# Altium schematic sheet Supplies_LDOs.SchDoc
size 406 x 406 mm
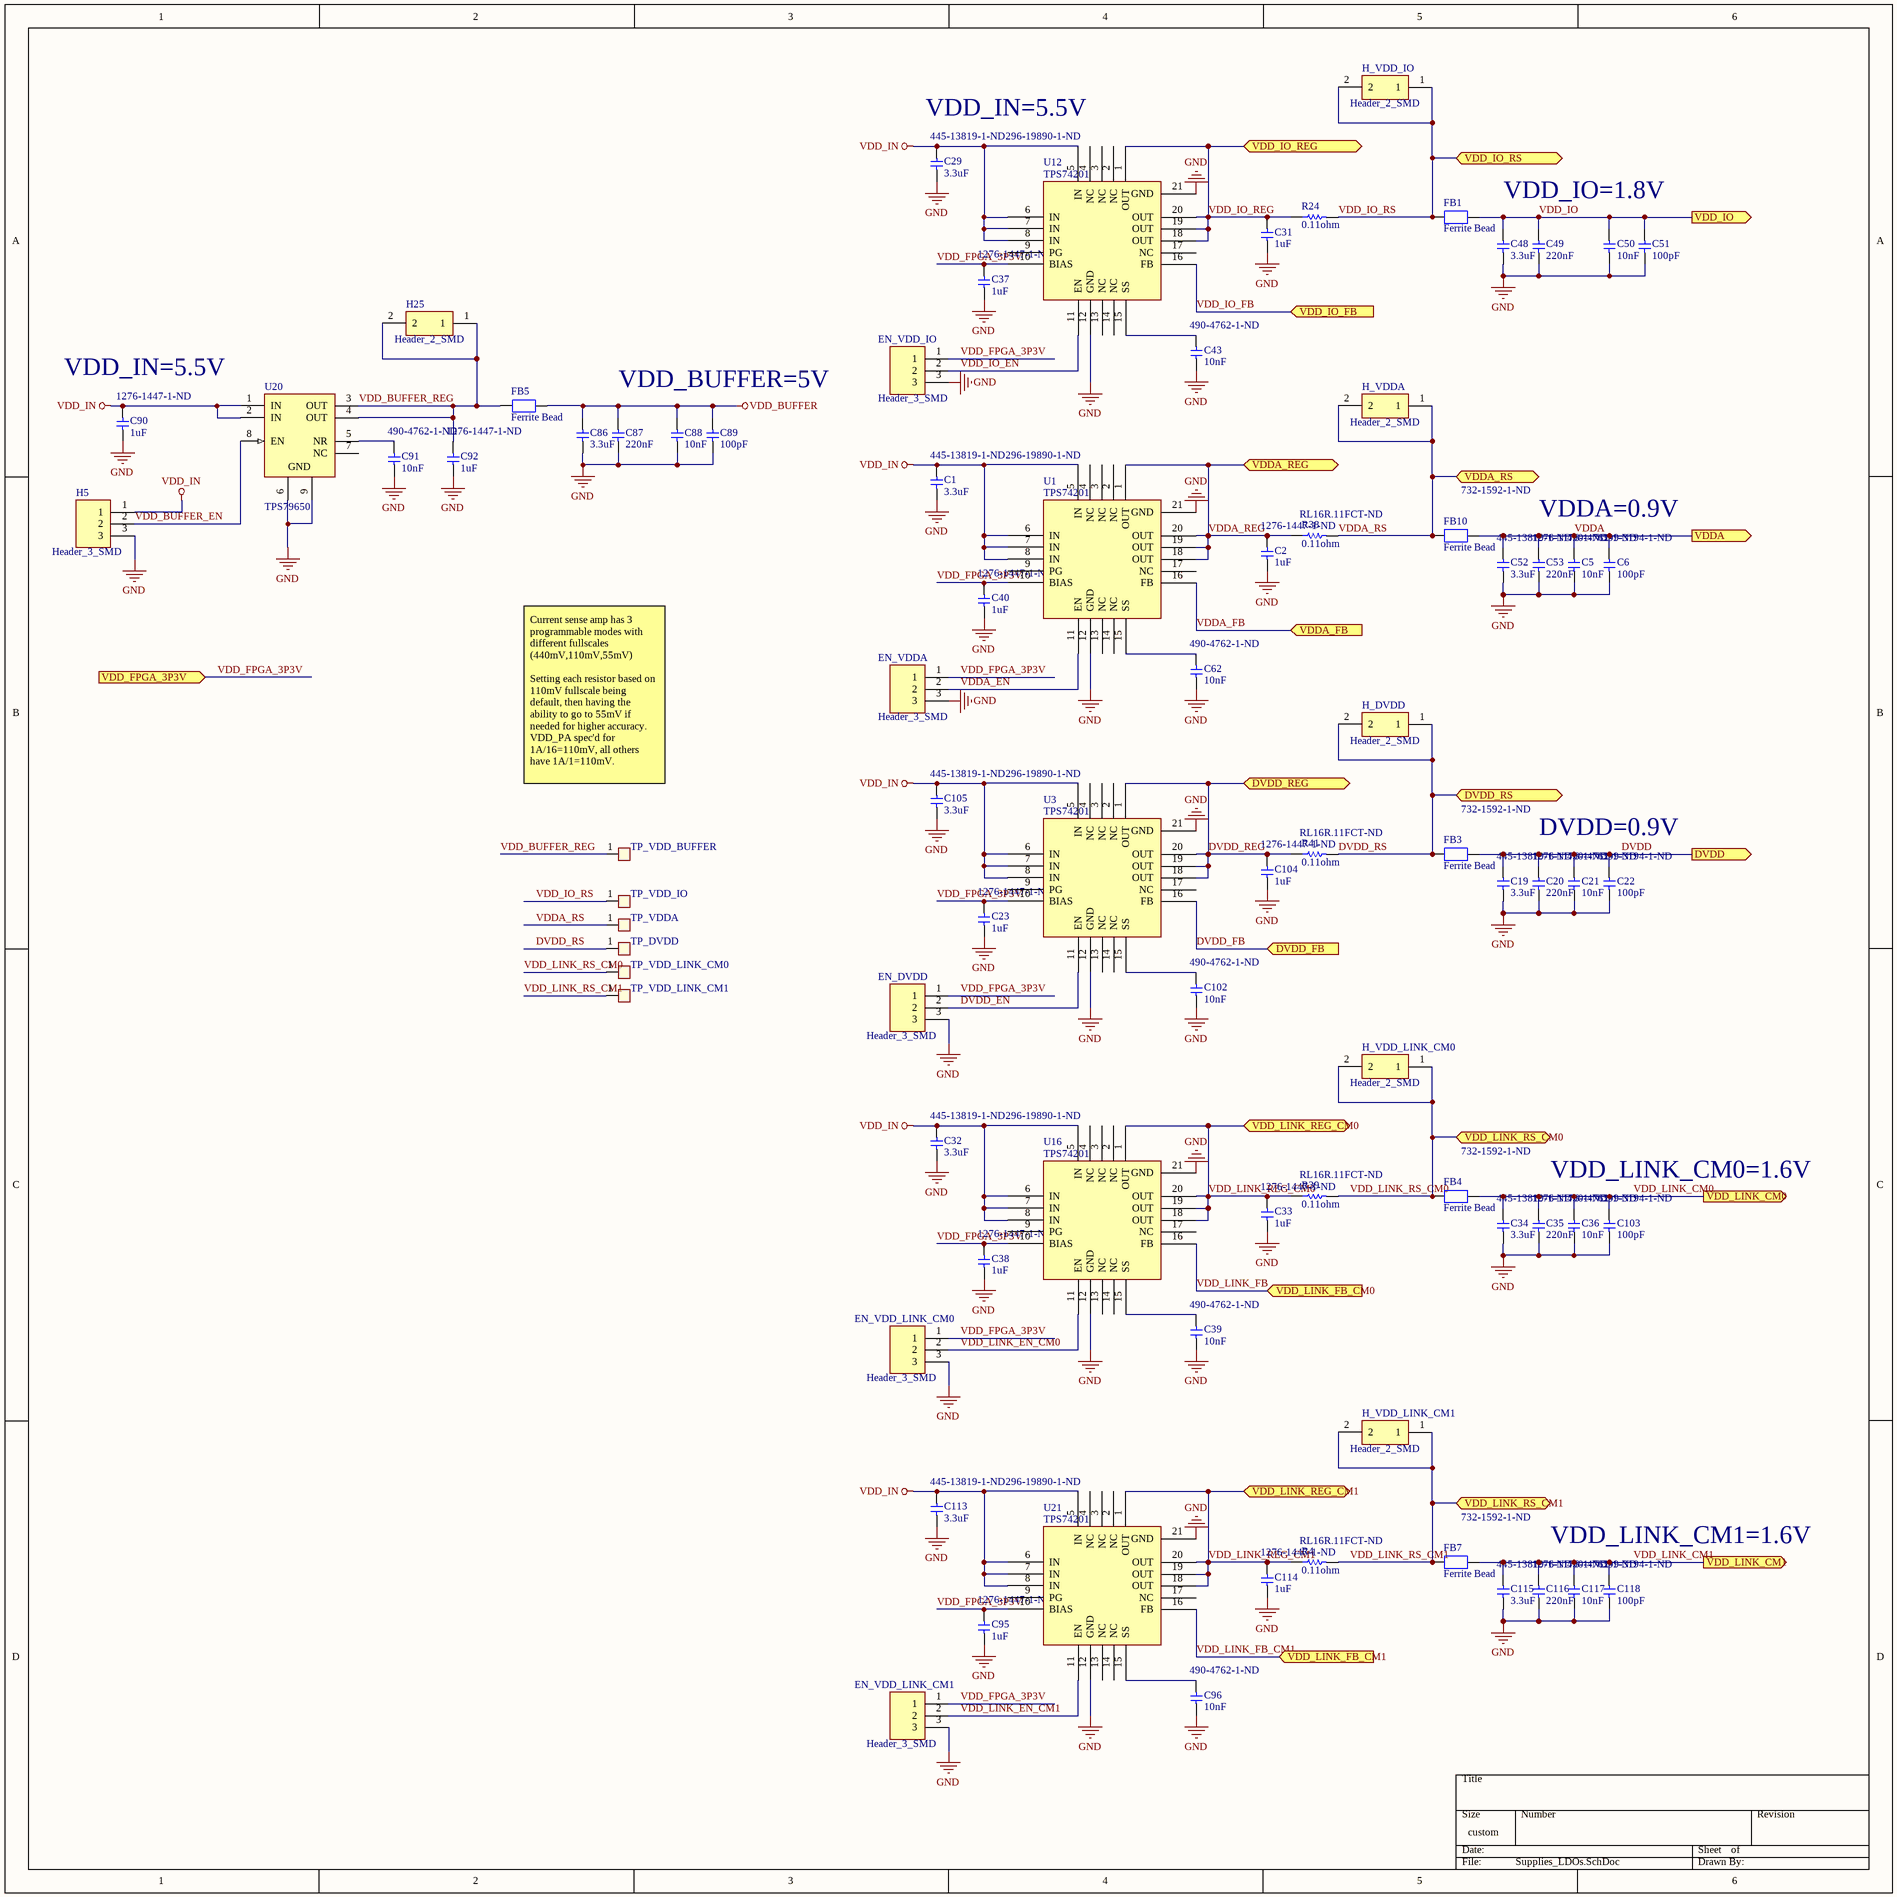
[diagram p0: Supplies_LDOs.SchDoc]

## Parts
C1  3.3uF  Supplier Part Number 1: 445-13819-1-ND  [CAP_0402]
C2  1uF  Supplier Part Number 1: 1276-1447-1-ND  [CAP_0402]
C5  10nF  Supplier Part Number 1: 490-4762-1-ND  [CAPC1005X06L_HD]
C6  100pF  Supplier Part Number 1: 399-3194-1-ND  [CAPC1005X06L_HD]
C19  3.3uF  Supplier Part Number 1: 445-13819-1-ND  [CAP_0402]
C20  220nF  Supplier Part Number 1: 1276-1176-1-ND  [CAP_0402]
C21  10nF  Supplier Part Number 1: 490-4762-1-ND  [CAPC1005X06L_HD]
C22  100pF  Supplier Part Number 1: 399-3194-1-ND  [CAPC1005X06L_HD]
C23  1uF  Supplier Part Number 1: 1276-1447-1-ND  [CAP_0402]
C29  3.3uF  Supplier Part Number 1: 445-13819-1-ND  [CAP_0402]
C31  1uF  [CAP_0402]
C32  3.3uF  Supplier Part Number 1: 445-13819-1-ND  [CAP_0402]
C33  1uF  Supplier Part Number 1: 1276-1447-1-ND  [CAP_0402]
C34  3.3uF  Supplier Part Number 1: 445-13819-1-ND  [CAP_0402]
C35  220nF  Supplier Part Number 1: 1276-1176-1-ND  [CAP_0402]
C36  10nF  Supplier Part Number 1: 490-4762-1-ND  [CAPC1005X06L_HD]
C37  1uF  Supplier Part Number 1: 1276-1447-1-ND  [CAP_0402]
C38  1uF  Supplier Part Number 1: 1276-1447-1-ND  [CAP_0402]
C39  10nF  Supplier Part Number 1: 490-4762-1-ND  [CAPC1005X06L_HD]
C40  1uF  Supplier Part Number 1: 1276-1447-1-ND  [CAP_0402]
C43  10nF  Supplier Part Number 1: 490-4762-1-ND  [CAPC1005X06L_HD]
C48  3.3uF  [CAP_0402]
C49  220nF  [CAP_0402]
C50  10nF  [CAPC1005X06L_HD]
C51  100pF  [CAPC1005X06L_HD]
C52  3.3uF  Supplier Part Number 1: 445-13819-1-ND  [CAP_0402]
C53  220nF  Supplier Part Number 1: 1276-1176-1-ND  [CAP_0402]
C62  10nF  Supplier Part Number 1: 490-4762-1-ND  [CAPC1005X06L_HD]
C86  3.3uF  [CAP_0402]
C87  220nF  [CAP_0402]
C88  10nF  [CAPC1005X06L_HD]
C89  100pF  [CAPC1005X06L_HD]
C90  1uF  Supplier Part Number 1: 1276-1447-1-ND  [CAP_0402]
C91  10nF  Supplier Part Number 1: 490-4762-1-ND  [CAPC1005X06L_HD]
C92  1uF  Supplier Part Number 1: 1276-1447-1-ND  [CAP_0402]
C95  1uF  Supplier Part Number 1: 1276-1447-1-ND  [CAP_0402]
C96  10nF  Supplier Part Number 1: 490-4762-1-ND  [CAPC1005X06L_HD]
C102  10nF  Supplier Part Number 1: 490-4762-1-ND  [CAPC1005X06L_HD]
C103  100pF  Supplier Part Number 1: 399-3194-1-ND  [CAPC1005X06L_HD]
C104  1uF  Supplier Part Number 1: 1276-1447-1-ND  [CAP_0402]
C105  3.3uF  Supplier Part Number 1: 445-13819-1-ND  [CAP_0402]
C113  3.3uF  Supplier Part Number 1: 445-13819-1-ND  [CAP_0402]
C114  1uF  Supplier Part Number 1: 1276-1447-1-ND  [CAP_0402]
C115  3.3uF  Supplier Part Number 1: 445-13819-1-ND  [CAP_0402]
C116  220nF  Supplier Part Number 1: 1276-1176-1-ND  [CAP_0402]
C117  10nF  Supplier Part Number 1: 490-4762-1-ND  [CAPC1005X06L_HD]
C118  100pF  Supplier Part Number 1: 399-3194-1-ND  [CAPC1005X06L_HD]
EN_DVDD  Header_3_SMD  [HDR1X3_SMD]
EN_VDD_IO  Header_3_SMD  [HDR1X3_SMD]
EN_VDD_LINK_CM0  Header_3_SMD  [HDR1X3_SMD]
EN_VDD_LINK_CM1  Header_3_SMD  [HDR1X3_SMD]
EN_VDDA  Header_3_SMD  [HDR1X3_SMD]
FB1  Ferrite Bead  [FER_SMD-0603]
FB3  Ferrite Bead  Supplier Part Number 1: 732-1592-1-ND  [FER_SMD-0603]
FB4  Ferrite Bead  Supplier Part Number 1: 732-1592-1-ND  [FER_SMD-0603]
FB5  Ferrite Bead  [FER_SMD-0603]
FB7  Ferrite Bead  Supplier Part Number 1: 732-1592-1-ND  [FER_SMD-0603]
FB10  Ferrite Bead  Supplier Part Number 1: 732-1592-1-ND  [FER_SMD-0603]
H5  Header_3_SMD  [HDR1X3_SMD]
H25  Header_2_SMD  [HDR1X2_SMD_S]
H_DVDD  Header_2_SMD  [HDR1X2_SMD_S]
H_VDD_IO  Header_2_SMD  [HDR1X2_SMD_S]
H_VDD_LINK_CM0  Header_2_SMD  [HDR1X2_SMD_S]
H_VDD_LINK_CM1  Header_2_SMD  [HDR1X2_SMD_S]
H_VDDA  Header_2_SMD  [HDR1X2_SMD_S]
R4  0.11ohm  Supplier Part Number 1: RL16R.11FCT-ND  [RES_1206]
R24  0.11ohm  [RES_1206]
R38  0.11ohm  Supplier Part Number 1: RL16R.11FCT-ND  [RES_1206]
R39  0.11ohm  Supplier Part Number 1: RL16R.11FCT-ND  [RES_1206]
R41  0.11ohm  Supplier Part Number 1: RL16R.11FCT-ND  [RES_1206]
TP_DVDD  TestPoint_SMD  [TestPoint_SMD]  (value not drawn)
TP_VDD_BUFFER  TestPoint_SMD  [TestPoint_SMD]  (value not drawn)
TP_VDD_IO  TestPoint_SMD  [TestPoint_SMD]  (value not drawn)
TP_VDD_LINK_CM0  TestPoint_SMD  [TestPoint_SMD]  (value not drawn)
TP_VDD_LINK_CM1  TestPoint_SMD  [TestPoint_SMD]  (value not drawn)
TP_VDDA  TestPoint_SMD  [TestPoint_SMD]  (value not drawn)
U1  TPS74201  Supplier Part Number 1: 296-19890-1-ND  [TPS74201_NPV]
U3  TPS74201  Supplier Part Number 1: 296-19890-1-ND  [TPS74201_NPV]
U12  TPS74201  Supplier Part Number 1: 296-19890-1-ND  [TPS74201_NPV]
U16  TPS74201  Supplier Part Number 1: 296-19890-1-ND  [TPS74201_NPV]
U20  TPS79650  [TI-DRB8-2400X1650TP_V]
U21  TPS74201  Supplier Part Number 1: 296-19890-1-ND  [TPS74201_NPV]

## Ports
DVDD (out), DVDD_FB (in), DVDD_REG (bidir), DVDD_RS (bidir), VDD_FPGA_3P3V (in), VDD_IO (out), VDD_IO_FB (in), VDD_IO_REG (bidir), VDD_IO_RS (bidir), VDD_LINK_CM0 (out), VDD_LINK_CM1 (out), VDD_LINK_FB_CM0 (in), VDD_LINK_FB_CM1 (in), VDD_LINK_REG_CM0 (bidir), VDD_LINK_REG_CM1 (bidir), VDD_LINK_RS_CM0 (bidir), VDD_LINK_RS_CM1 (bidir), VDDA (out), VDDA_FB (in), VDDA_REG (bidir), VDDA_RS (bidir)

## Nets
GND: C1.2 C2.2 C5.2 C6.2 C19.2 C20.2 C21.2 C22.2 C23.2 C29.2 C31.2 C32.2 C33.2 C34.2 C35.2 C36.2 C37.2 C38.2 C39.2 C40.2 C43.2 C48.2 C49.2 C50.2 C51.2 C52.2 C53.2 C62.2 C86.2 C87.2 C88.2 C89.2 C90.2 C91.2 C92.2 C95.2 C96.2 C102.2 C103.2 C104.2 C105.2 C113.2 C114.2 C115.2 C116.2 C117.2 C118.2 EN_DVDD.3 EN_VDD_IO.3 EN_VDD_LINK_CM0.3 EN_VDD_LINK_CM1.3 EN_VDDA.3 H5.3 U1.12(GND) U1.21(GND) U3.12(GND) U3.21(GND) U12.12(GND) U12.21(GND) U16.12(GND) U16.21(GND) U20.6(GND) U20.9(GND) U21.12(GND) U21.21(GND)
VDD_BUFFER: C86.1 C87.1 C88.1 C89.1 FB5.2
VDD_IN: C1.1 C29.1 C32.1 C90.1 C105.1 C113.1 H5.1 U1.5(IN) U1.6(IN) U1.7(IN) U1.8(IN) U3.5(IN) U3.6(IN) U3.7(IN) U3.8(IN) U12.5(IN) U12.6(IN) U12.7(IN) U12.8(IN) U16.5(IN) U16.6(IN) U16.7(IN) U16.8(IN) U20.1(IN) U20.2(IN) U21.5(IN) U21.6(IN) U21.7(IN) U21.8(IN)
DVDD: C19.1 C20.1 C21.1 C22.1 FB3.2 ; port DVDD
DVDD_EN: EN_DVDD.2 U3.11(EN)
DVDD_FB: U3.16(FB) ; port DVDD_FB
DVDD_REG: C104.1 R41.1(TOP) U3.1(OUT) U3.18(OUT) U3.19(OUT) U3.20(OUT) ; port DVDD_REG
DVDD_RS: FB3.1 H_DVDD.1 H_DVDD.2 R41.2(BOT) TP_DVDD.1(TP) ; port DVDD_RS
VDD_BUFFER_EN: H5.2 U20.8(EN)
VDD_BUFFER_REG: C92.1 FB5.1 H25.1 H25.2 TP_VDD_BUFFER.1(TP) U20.3(OUT) U20.4(OUT)
VDD_FPGA_3P3V: C23.1 C37.1 C38.1 C40.1 C95.1 EN_DVDD.1 EN_VDD_IO.1 EN_VDD_LINK_CM0.1 EN_VDD_LINK_CM1.1 EN_VDDA.1 U1.10(BIAS) U3.10(BIAS) U12.10(BIAS) U16.10(BIAS) U21.10(BIAS) ; port VDD_FPGA_3P3V
VDD_IO: C48.1 C49.1 C50.1 C51.1 FB1.2 ; port VDD_IO
VDD_IO_EN: EN_VDD_IO.2 U12.11(EN)
VDD_IO_FB: U12.16(FB) ; port VDD_IO_FB
VDD_IO_REG: C31.1 R24.1(TOP) U12.1(OUT) U12.18(OUT) U12.19(OUT) U12.20(OUT) ; port VDD_IO_REG
VDD_IO_RS: FB1.1 H_VDD_IO.1 H_VDD_IO.2 R24.2(BOT) TP_VDD_IO.1(TP) ; port VDD_IO_RS
VDD_LINK_CM0: C34.1 C35.1 C36.1 C103.1 FB4.2 ; port VDD_LINK_CM0
VDD_LINK_CM1: C115.1 C116.1 C117.1 C118.1 FB7.2 ; port VDD_LINK_CM1
VDD_LINK_EN_CM0: EN_VDD_LINK_CM0.2 U16.11(EN)
VDD_LINK_EN_CM1: EN_VDD_LINK_CM1.2 U21.11(EN)
VDD_LINK_FB: U16.16(FB) ; port VDD_LINK_FB_CM0
VDD_LINK_FB_CM1: U21.16(FB) ; port VDD_LINK_FB_CM1
VDD_LINK_REG_CM0: C33.1 R39.1(TOP) U16.1(OUT) U16.18(OUT) U16.19(OUT) U16.20(OUT) ; port VDD_LINK_REG_CM0
VDD_LINK_REG_CM1: C114.1 R4.1(TOP) U21.1(OUT) U21.18(OUT) U21.19(OUT) U21.20(OUT) ; port VDD_LINK_REG_CM1
VDD_LINK_RS_CM0: FB4.1 H_VDD_LINK_CM0.1 H_VDD_LINK_CM0.2 R39.2(BOT) TP_VDD_LINK_CM0.1(TP) ; port VDD_LINK_RS_CM0
VDD_LINK_RS_CM1: FB7.1 H_VDD_LINK_CM1.1 H_VDD_LINK_CM1.2 R4.2(BOT) TP_VDD_LINK_CM1.1(TP) ; port VDD_LINK_RS_CM1
VDDA: C5.1 C6.1 C52.1 C53.1 FB10.2 ; port VDDA
VDDA_EN: EN_VDDA.2 U1.11(EN)
VDDA_FB: U1.16(FB) ; port VDDA_FB
VDDA_REG: C2.1 R38.1(TOP) U1.1(OUT) U1.18(OUT) U1.19(OUT) U1.20(OUT) ; port VDDA_REG
VDDA_RS: FB10.1 H_VDDA.1 H_VDDA.2 R38.2(BOT) TP_VDDA.1(TP) ; port VDDA_RS
NetC39_1: C39.1 U16.15(SS)
NetC43_1: C43.1 U12.15(SS)
NetC62_1: C62.1 U1.15(SS)
NetC91_1: C91.1 U20.5(NR)
NetC96_1: C96.1 U21.15(SS)
NetC102_1: C102.1 U3.15(SS)

Not connected (* = marked no-connect by the designer): U1 2(NC) 3(NC) 4(NC) 9(PG) 13(NC) 14(NC) 17(NC); U3 2(NC) 3(NC) 4(NC) 9(PG) 13(NC) 14(NC) 17(NC); U12 2(NC) 3(NC) 4(NC) 9(PG) 13(NC) 14(NC) 17(NC); U16 2(NC) 3(NC) 4(NC) 9(PG) 13(NC) 14(NC) 17(NC); U20 7(NC); U21 2(NC) 3(NC) 4(NC) 9(PG) 13(NC) 14(NC) 17(NC)

## Notes on the sheet
- (near C29) VDD_IN=5.5V
- VDD_IO=1.8V
- (near C90) VDD_IN=5.5V
- VDD_BUFFER=5V
- VDDA=0.9V
- Current sense amp has 3 programmable modes with different fullscales (440mV,110mV,55mV)
  Setting each resistor based on 110mV fullscale being default, then having the ability to go to 55mV if needed for higher accuracy. VDD_PA spec'd for 1A/16=110mV, all others have 1A/1=110mV.
- DVDD=0.9V
- VDD_LINK_CM0=1.6V
- VDD_LINK_CM1=1.6V

## Library data of the parts
C1 C19 C29 C32 C34 C48 C52 C86 C105 C113 C115 = cap 3p3uF: CAP CER 3.3uF 10% 10V X5R 0402; Manufacturer: TDK; Manufacturer ID: C1005X5R1A335K050BC; Digikey ID: 445-13819-1-ND; Value: 3.3uF; Package: 0402; Supplier 1: Digi-Key
  C48 C86: Supplier Part Number 1: 445-13819-1-ND
C2 C23 C31 C33 C37 C38 C40 C90 C92 C95 C104 C114 = cap 1uF 0402: CAP CER 1uF 20% 16V X5R 0402; Manufacturer: Samsung Electro-Mechanics; Manufacturer ID: CL05A105MO5NNNC; Digikey ID: 1276-1447-1-ND; Value: 1uF; Package: 0402; Supplier 1: Digi-Key
  C31: Supplier Part Number 1: 1276-1447-1-ND
C5 C21 C36 C39 C43 C50 C62 C88 C91 C96 C102 C117 = cap 10nF: CAP CER 10nF 10% 50V X7R 0402; Manufacturer: Murata; Manufacturer ID: GCM155R71H103KA55D; Value: 10000pF; Digikey ID: 490-4762-1-ND; Package: 0402; Supplier 1: Digi-Key
  C50 C88: Supplier Part Number 1: 490-4762-1-ND
C6 C22 C51 C89 C103 C118 = cap 100pF 0402: CAP CER 100pF 5% 50V C0G/NP0 0402; Manufacturer: Kemet; Manufacturer ID: C0402C101J5GACTU; Digikey ID: 399-3194-1-ND; Value: 100pF; Package: 0402; Supplier 1: Digi-Key
  C51 C89: Supplier Part Number 1: 399-3194-1-ND
C20 C35 C49 C53 C87 C116 = cap 220nF: CAP CER 0.22uF 10% 16V X7R 0402; Manufacturer: Samsung Electro-Mechanics; Manufacturer ID: CL05B224KO5NNNC; Digikey ID: 1276-1176-1-ND; Value: 0.22uF; Package: 0402; Supplier 1: Digi-Key
  C49 C87: Supplier Part Number 1: 1276-1176-1-ND
EN_DVDD EN_VDD_IO EN_VDD_LINK_CM0 EN_VDD_LINK_CM1 EN_VDDA H5 = Header_3_SMD: Connector Header Vertical, SMD, 3 position 0.100" (2.54mm); Manufacturer_Name: SAMTEC; Manufacturer_Part_Number: TSM-103-01-S-SV-P-TR; Datasheet Link: http://suddendocs.samtec.com/prints/tsm-1xx-xx-xxx-sv-xx-xxx-xx-mkt.pdf; Height: 11.17mm; Arrow Part Number: TSM-103-01-S-SV-P-TR; Arrow Price/Stock: https://www.arrow.com/en/products/tsm-103-01-s-sv-p-tr/samtec; Mouser Part Number: 200-TSM10301SSVPTR; Mouser Price/Stock: https://www.mouser.co.uk/ProductDetail/Samtec/TSM-103-01-S-SV-P-TR?qs=FESYatJ8odJI6Ns4akqicQ%3D%3D; Supplier 1: Newark; Supplier 2: Digi-Key; Supplier Part Number 1: 80K8300; Supplier Part Number 2: SAM13283CT-ND
FB1 FB3-FB5 FB7 FB10 = Ferrite Bead: Ferrite Bead 300 Ohms @ 100MHz 1 Signal Line 0603 (1608 Metric) 2A 150mOhm; Manufacturer: Wurth; Manufacturer ID: 742792641; Impedance: 300 Ohm @ 100MHz; Digikey ID: 732-1592-1-ND; Current Rating: 2A; Package: 0603; Supplier 1: Digi-Key
  FB1 FB5: Supplier Part Number 1: 732-1592-1-ND
H25 H_DVDD H_VDD_IO H_VDD_LINK_CM0 H_VDD_LINK_CM1 H_VDDA = Header_2_SMD: Connector Header Vertical, SMD, 2 position 0.100" (2.54mm); Manufacturer_Name: SAMTEC; Manufacturer_Part_Number: TSM-102-01-S-SV; Datasheet Link: https://componentsearchengine.com/Datasheets/2/TSM-102-01-S-SV.pdf; Arrow Part Number: TSM-102-01-S-SV; Arrow Price/Stock: https://www.arrow.com/en/products/tsm-102-01-s-sv/samtec; Mouser Part Number: 200-TSM10201SSV; Mouser Price/Stock: https://www.mouser.co.uk/ProductDetail/Samtec/TSM-102-01-S-SV?qs=FESYatJ8odJNSemiJZ%2Fyzw%3D%3D; Supplier 1: Digi-Key; Supplier Part Number 1: SAM10783-ND
R4 R24 R38 R39 R41 = res 0.11 ohm: RES 0.11 OHM 1% 1/2W 1206; Manufacturer: Susumu; Manufacturer ID: RL1632R-R110-F; Digikey ID: RL16R.11FCT-ND; Package: 1206; Supplier 1: Digi-Key
  R24: Supplier Part Number 1: RL16R.11FCT-ND
TP_DVDD TP_VDD_BUFFER TP_VDD_IO TP_VDD_LINK_CM0 TP_VDD_LINK_CM1 TP_VDDA = TestPoint_SMD: Test Point, SMD 1mm x 1.8mm, 1.15mm high.; Supplier 1: Digi-Key; Supplier Part Number 1: 952-2665-1-ND
U1 U3 U12 U16 U21 = TPS74201: Linear Positive Voltage Regulator IC, Adjustable Voltage, 1 Output 1.5A 20-VQFN (5x5); Manufacturer: TI; Manufacturer ID: TPS74201RGWR; Output Voltage: 0.8V-3.6V; Dropout Voltage: 55mV @ 1.5A; Input Voltage: 0.86V-5.5V; Digikey ID: 296-19890-1-ND; Output Current: 1.5A; Supplier 1: Digi-Key
U20 = TPS79650DRBR: Single Output High PSRR LDO, 1 A, Fixed 5 V Output, 2.7 to 5.5 V Input, 8-pin SON (DRB), -40 to 125 degC, Green (RoHS & no Sb/Br); Manufacturer: Texas Instruments; Accuracy(%): 2; Fixed Output Options(V): 5; Iout(Max)(A): 1; Iq(Typ)(mA): 0.26; SubFamily: Single Channel LDO; Vdo(Typ)(mV): 200; Vin(Max)(V): 5.5; Vin(Min)(V): 2.7; DatasheetVersion: SLVS351N; PackageVersion: 4203482-2/K; PackageReference: DRB8-2400X1650TP; PackageDescription: 8-Pin Plastic Small Outline, Body 3 x 3 mm, Pitch 0.65 mm; Supplier 1: Digi-Key; Supplier Part Number 1: 296-21352-2-ND; Supplier 2: Digi-Key; Supplier Part Number 2: 296-21352-1-ND; Supplier 3: Digi-Key; Supplier Part Number 3: 296-21352-6-ND; Supplier 4: Newark; Supplier Part Number 4: 22M1831; Supplier 5: Mouser; Supplier Part Number 5: 595-TPS79650DRBR; Eco-Plan: Green (RoHS & no Sb/Br); Vout Adj(Max)(V): 5; Vout Adj(Min)(V): 5; Mounting Technology: Surface Mount; PartNumber: TPS79650DRBR; ComponentLink1Description: Manufacturer URL; ComponentLink1URL: http://www.ti.com/; ComponentLink2Description: Datasheet; ComponentLink2URL: http://www.ti.com/general/docs/lit/getliterature.tsp?genericPartNumber=TPS79650&fileType=pdf; ComponentLink3Description: Package Specification; ComponentLink3URL: http://www.ti.com/litv/pdf/mpds118h; Digikey ID: 296-21352-1-ND; Manufacturer ID: TPS79650DRBR